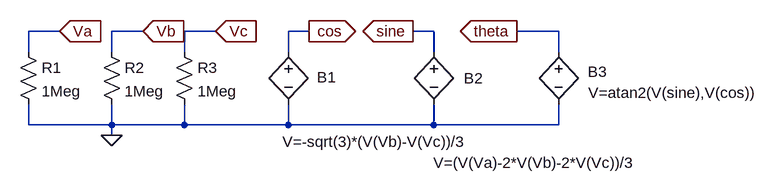
[diagram p0: schematic theta_sub.asc]
theta_sub.asc, the LTspice schematic file:
Version 4
SHEET 1 1508 680
WIRE 96 64 48 64
WIRE 224 64 176 64
WIRE 336 64 288 64
WIRE 480 64 448 64
WIRE 672 64 640 64
WIRE 864 64 800 64
WIRE 48 96 48 64
WIRE 176 96 176 64
WIRE 288 96 288 64
WIRE 448 96 448 64
WIRE 672 96 672 64
WIRE 864 96 864 64
WIRE 48 208 48 176
WIRE 176 208 176 176
WIRE 176 208 48 208
WIRE 288 208 288 176
WIRE 288 208 176 208
WIRE 448 208 448 176
WIRE 448 208 288 208
WIRE 672 208 672 176
WIRE 672 208 448 208
WIRE 864 208 864 176
WIRE 864 208 672 208
WIRE 176 224 176 208
FLAG 176 224 0
FLAG 96 64 Va
IOPIN 96 64 In
FLAG 224 64 Vb
IOPIN 224 64 In
FLAG 336 64 Vc
IOPIN 336 64 In
FLAG 480 64 cos
IOPIN 480 64 Out
FLAG 640 64 sine
IOPIN 640 64 Out
FLAG 800 64 theta
IOPIN 800 64 Out
SYMBOL res 32 80 R0
SYMATTR InstName R1
SYMATTR Value 1Meg
SYMBOL res 160 80 R0
SYMATTR InstName R2
SYMATTR Value 1Meg
SYMBOL res 272 80 R0
SYMATTR InstName R3
SYMATTR Value 1Meg
SYMBOL bv 448 80 R0
WINDOW 0 44 55 Left 2
WINDOW 3 -9 154 Left 2
SYMATTR InstName B1
SYMATTR Value V=-sqrt(3)*(V(Vb)-V(Vc))/3
SYMBOL bv 672 80 R0
WINDOW 0 46 56 Left 2
WINDOW 3 -1 186 Left 2
SYMATTR InstName B2
SYMATTR Value V=(V(Va)-2*V(Vb)-2*V(Vc))/3
SYMBOL bv 864 80 R0
WINDOW 0 45 46 Left 2
WINDOW 3 46 79 Left 2
SYMATTR InstName B3
SYMATTR Value V=atan2(V(sine),V(cos))

The netlist it stands for:
* theta_sub.asc
R1 Va 0 1Meg
R2 Vb 0 1Meg
R3 Vc 0 1Meg
B1 cos 0 V=-sqrt(3)*(V(Vb)-V(Vc))/3
B2 sine 0 V=(V(Va)-2*V(Vb)-2*V(Vc))/3
B3 theta 0 V=atan2(V(sine),V(cos))
.backanno
.end